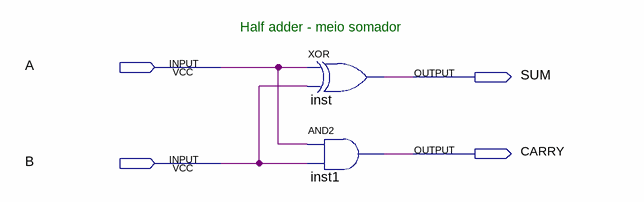
[diagram p0: schematic sheet]
// Quartus schematic half_adder.bdf as structural Verilog: 2 symbols, 4 pins
module half_adder (
  input  A,
  input  B,
  output SUM,
  output CARRY
);

  xor inst (SUM, A, B);
  and inst1 (CARRY, A, B);

  // Notes on the sheet:
  //   Half adder - meio somador
endmodule
